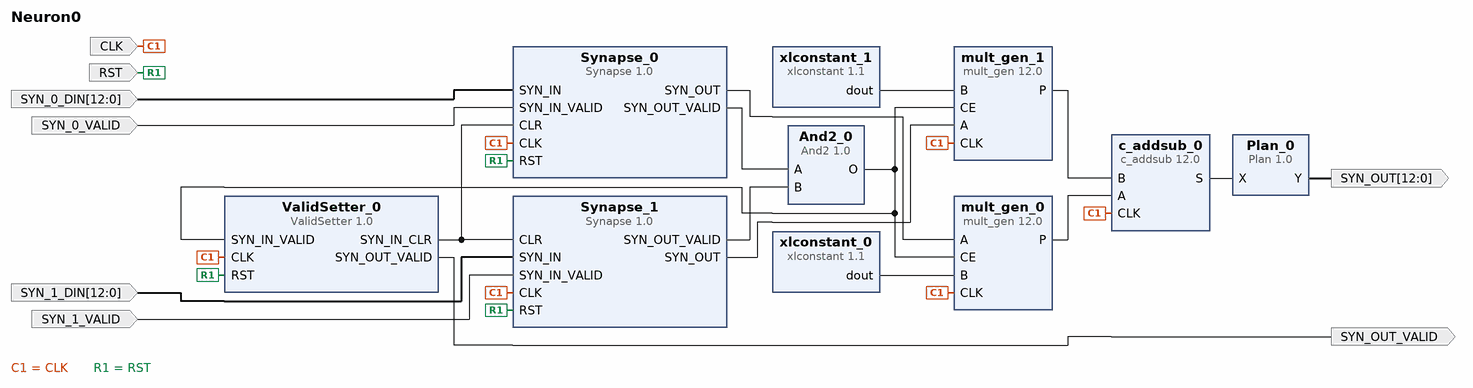
[diagram p0: block diagram of the top level]
# Vivado block design Neuron0, Vivado 2014.2
create_bd_design Neuron0

create_bd_port -dir I -type clk CLK
create_bd_port -dir I -type rst RST
create_bd_port -dir I -from 12 -to 0 -type data SYN_0_DIN
create_bd_port -dir I SYN_0_VALID
create_bd_port -dir I -from 12 -to 0 -type data SYN_1_DIN
create_bd_port -dir I SYN_1_VALID
create_bd_port -dir O SYN_OUT_VALID
create_bd_port -dir O -from 12 -to 0 -type data SYN_OUT

create_bd_cell -type ip -vlnv xilinx.com:ip:mult_gen:12.0 mult_gen_0
set_property -dict [list \
  CONFIG.PortAType Signed \
  CONFIG.PortAWidth 13 \
  CONFIG.PortBType Signed \
  CONFIG.PortBWidth 13 \
  CONFIG.OptGoal Area \
  CONFIG.Use_Custom_Output_Width true \
  CONFIG.OutputWidthHigh 12 \
  CONFIG.ClockEnable true \
] [get_bd_cells mult_gen_0]
create_bd_cell -type ip -vlnv xilinx.com:ip:c_addsub:12.0 c_addsub_0
set_property -dict [list \
  CONFIG.A_Type Signed \
  CONFIG.B_Type Signed \
  CONFIG.A_Width 13 \
  CONFIG.B_Width 13 \
  CONFIG.CE false \
] [get_bd_cells c_addsub_0]
create_bd_cell -type ip -vlnv xilinx.com:ip:xlconstant:1.1 xlconstant_0
set_property -dict {CONFIG.CONST_WIDTH 13} [get_bd_cells xlconstant_0]
create_bd_cell -type ip -vlnv oloftus.com:prif:And2:1.0 And2_0
create_bd_cell -type ip -vlnv xilinx.com:ip:mult_gen:12.0 mult_gen_1
set_property -dict [list \
  CONFIG.PortAType Signed \
  CONFIG.PortAWidth 13 \
  CONFIG.PortBType Signed \
  CONFIG.PortBWidth 13 \
  CONFIG.OptGoal Area \
  CONFIG.Use_Custom_Output_Width true \
  CONFIG.OutputWidthHigh 12 \
  CONFIG.ClockEnable true \
] [get_bd_cells mult_gen_1]
create_bd_cell -type ip -vlnv xilinx.com:ip:xlconstant:1.1 xlconstant_1
set_property -dict {CONFIG.CONST_WIDTH 13} [get_bd_cells xlconstant_1]
create_bd_cell -type ip -vlnv oloftus.com:prif:Synapse:1.0 Synapse_0
set_property -dict {CONFIG.size 13} [get_bd_cells Synapse_0]
create_bd_cell -type ip -vlnv oloftus.com:prif:Synapse:1.0 Synapse_1
set_property -dict {CONFIG.size 13} [get_bd_cells Synapse_1]
create_bd_cell -type ip -vlnv oloftus.com:prif:ValidSetter:1.0 ValidSetter_0
set_property -dict {CONFIG.latency 2} [get_bd_cells ValidSetter_0]
create_bd_cell -type ip -vlnv oloftus.com:prif:Plan:1.0 Plan_0
set_property -dict {CONFIG.fractionPrecision 6 CONFIG.integerPrecision 6} [get_bd_cells Plan_0]

# ---- connections ----

connect_bd_net [get_bd_pins Synapse_0/SYN_OUT] [get_bd_pins mult_gen_0/A]
connect_bd_net [get_bd_pins Synapse_1/SYN_OUT] [get_bd_pins mult_gen_1/A]
connect_bd_net [get_bd_pins xlconstant_0/dout] [get_bd_pins mult_gen_0/B]
connect_bd_net [get_bd_pins xlconstant_1/dout] [get_bd_pins mult_gen_1/B]
connect_bd_net [get_bd_pins Synapse_0/SYN_OUT_VALID] [get_bd_pins And2_0/A]
connect_bd_net [get_bd_pins Synapse_1/SYN_OUT_VALID] [get_bd_pins And2_0/B]
connect_bd_net [get_bd_pins And2_0/O] [get_bd_pins mult_gen_0/CE] [get_bd_pins mult_gen_1/CE] [get_bd_pins ValidSetter_0/SYN_IN_VALID]
connect_bd_net [get_bd_pins mult_gen_0/P] [get_bd_pins c_addsub_0/A]
connect_bd_net [get_bd_pins mult_gen_1/P] [get_bd_pins c_addsub_0/B]
connect_bd_net [get_bd_ports CLK] \
  [get_bd_pins mult_gen_0/CLK] [get_bd_pins mult_gen_1/CLK] [get_bd_pins c_addsub_0/CLK] [get_bd_pins Synapse_0/CLK] \
  [get_bd_pins Synapse_1/CLK] [get_bd_pins ValidSetter_0/CLK]
connect_bd_net [get_bd_ports RST] [get_bd_pins Synapse_0/RST] [get_bd_pins Synapse_1/RST] [get_bd_pins ValidSetter_0/RST]
connect_bd_net [get_bd_ports SYN_0_DIN] [get_bd_pins Synapse_0/SYN_IN]
connect_bd_net [get_bd_ports SYN_0_VALID] [get_bd_pins Synapse_0/SYN_IN_VALID]
connect_bd_net [get_bd_ports SYN_1_DIN] [get_bd_pins Synapse_1/SYN_IN]
connect_bd_net [get_bd_ports SYN_1_VALID] [get_bd_pins Synapse_1/SYN_IN_VALID]
connect_bd_net [get_bd_pins ValidSetter_0/SYN_IN_CLR] [get_bd_pins Synapse_0/CLR] [get_bd_pins Synapse_1/CLR]
connect_bd_net [get_bd_pins ValidSetter_0/SYN_OUT_VALID] [get_bd_ports SYN_OUT_VALID]
connect_bd_net [get_bd_pins c_addsub_0/S] [get_bd_pins Plan_0/X]
connect_bd_net [get_bd_pins Plan_0/Y] [get_bd_ports SYN_OUT]

validate_bd_design
save_bd_design
